# EAGLE design kitco5 (EAGLE 6.1)
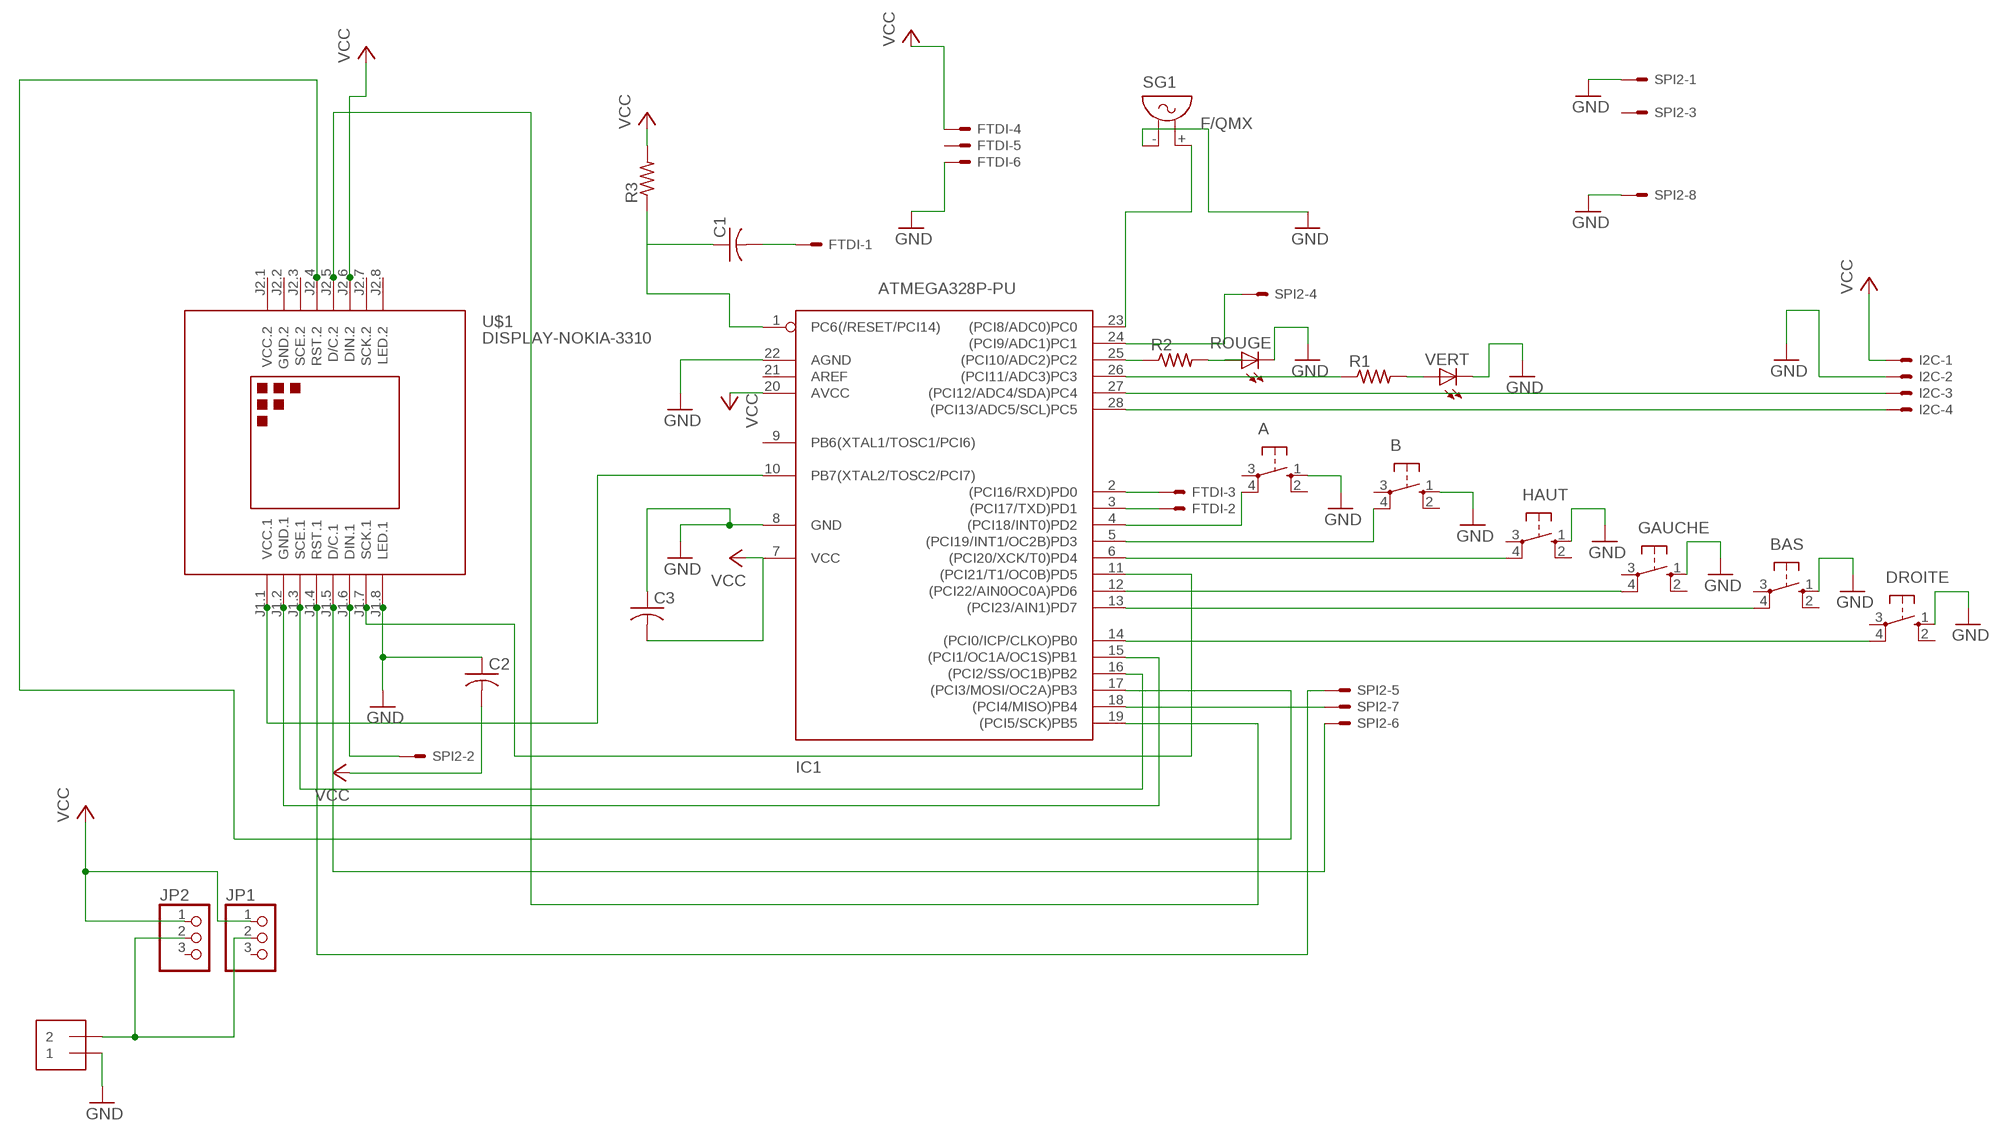
[diagram p0: schematic, sheet 1]

## Parts
A  10-XX  [B3F-10XX]
B  10-XX  [B3F-10XX]
BAS  10-XX  [B3F-10XX]
C1  C-US025-040X050  [C025-040X050]
C2  C-US025-040X050  [C025-040X050]
C3  C-US025-040X050  [C025-040X050]
DROITE  10-XX  [B3F-10XX]
FTDI  22-23-2061  [22-23-2061]
GAUCHE  10-XX  [B3F-10XX]
HAUT  10-XX  [B3F-10XX]
I2C  22-23-2041  [22-23-2041]
IC1  ATMEGA328P-PU  ATMEGA168V-10P  [DIL28-3]
J1  1X2-3.5MM  [1X2-3.5MM]
JP1  PINHD-1X3  [1X03]
JP2  PINHD-1X3  [1X03]
R1  R-US_0207/10  [0207/10]
R2  R-US_0207/10  [0207/10]
R3  R-US_0207/10  [0207/10]
ROUGE  LED5MM  [LED5MM]
SG1  F/QMX  [F/QMX]
SPI2  22-23-2081  [22-23-2081]
U$1  DISPLAY-NOKIA-3310  [DISPLAY-NOKIA-3310]
VERT  LED5MM  [LED5MM]

## Nets
GND: A.1(S) B.1(S) BAS.1(S) C2.1 C3.1 DROITE.1(S) FTDI.6 GAUCHE.1(S) HAUT.1(S) I2C.2 IC1.8(GND) IC1.22(AGND) J1.1 ROUGE.K(C) SG1.- SPI2.1 SPI2.8 U$1.J1.8(LED.1) VERT.K(C)
N$1: A.4(P1) IC1.4((PCI18/INT0)PD2)
N$2: B.4(P1) IC1.5((PCI19/INT1/OC2B)PD3)
N$3: IC1.11((PCI21/T1/OC0B)PD5) U$1.J1.7(SCK.1)
N$4: GAUCHE.4(P1) IC1.12((PCI22/AIN0OC0A)PD6)
N$5: BAS.4(P1) IC1.13((PCI23/AIN1)PD7)
N$6: DROITE.4(P1) IC1.14((PCI0/ICP/CLKO)PB0)
N$7: I2C.3 IC1.27((PCI12/ADC4/SDA)PC4)
N$8: I2C.4 IC1.28((PCI13/ADC5/SCL)PC5)
N$9: J1.2 JP1.2 JP2.2
N$10: HAUT.4(P1) IC1.6((PCI20/XCK/T0)PD4)
N$11: FTDI.2 IC1.3((PCI17/TXD)PD1)
N$12: IC1.26((PCI11/ADC3)PC3) R1.1
N$13: R1.2 VERT.A
N$14: IC1.25((PCI10/ADC2)PC2) R2.1
N$15: R2.2 ROUGE.A
N$16: IC1.24((PCI9/ADC1)PC1) SPI2.4
N$17: IC1.17((PCI3/MOSI/OC2A)PB3) U$1.J2.4(RST.2)
N$18: IC1.19((PCI5/SCK)PB5) U$1.J2.5(D/C.2)
N$19: IC1.15((PCI1/OC1A/OC1S)PB1) U$1.J1.2(GND.1)
N$20: IC1.16((PCI2/SS/OC1B)PB2) U$1.J1.3(SCE.1)
N$21: FTDI.3 IC1.2((PCI16/RXD)PD0)
N$22: IC1.18((PCI4/MISO)PB4) SPI2.7
N$23: IC1.23((PCI8/ADC0)PC0) SG1.+
N$24: SPI2.5 U$1.J1.4(RST.1)
N$25: C1.2 FTDI.1
N$26: SPI2.6 U$1.J1.5(D/C.1)
N$27: SPI2.2 U$1.J1.6(DIN.1)
N$29: C1.1 IC1.1(PC6(/RESET/PCI14)) R3.1
N$30: IC1.10(PB7(XTAL2/TOSC2/PCI7)) U$1.J1.1(VCC.1)
VCC: C2.2 C3.2 FTDI.4 I2C.1 IC1.7(VCC) IC1.20(AVCC) JP1.1 JP2.1 R3.2 U$1.J2.6(DIN.2)
Unconnected: A.2(S1) A.3(P) B.2(S1) B.3(P) BAS.2(S1) BAS.3(P) DROITE.2(S1) DROITE.3(P) FTDI.5 GAUCHE.2(S1) GAUCHE.3(P) HAUT.2(S1) HAUT.3(P) IC1.9(PB6(XTAL1/TOSC1/PCI6)) IC1.21(AREF) JP1.3 JP2.3 SPI2.3 U$1.J2.3(SCE.2) U$1.J2.7(SCK.2) U$1.J2.8(LED.2)

## Power pins joined to a net without a drawn wire
GND.2: U$1.J2.2(GND.2)
VCC.2: U$1.J2.1(VCC.2)

## Library data of the parts
A B BAS DROITE GAUCHE HAUT = switch-omron:10-XX: OMRON SWITCH; MPN: B3F-1000; OC_FARNELL: 176432; OC_NEWARK: 36M3542
C1-C3 = adafruit:C-US: CAPACITOR, American symbol
FTDI = con-molex:22-23-2061: .100" (2.54mm) Center Header - 6 Pin; MF: MOLEX; MPN: 22-23-2061; OC_FARNELL: 1462922; OC_NEWARK: 27C1933
I2C = con-molex:22-23-2041: .100" (2.54mm) Center Header - 4 Pin; MF: MOLEX; MPN: 22-23-2041; OC_FARNELL: 1462920; OC_NEWARK: 38C0355
IC1 = adafruit:ATMEGA168*P: MICROCONTROLLER 16 kBytes FLASH 1 kBytes SRAM 512 Bytes EEPROM USART 8-channel 10 bit ADC
J1 = adafruit:1X2: 3.5mm Terminal block http://www.ladyada.net/library/pcb/eaglelibrary.html
JP1 JP2 = adafruit:PINHD-1X3: PIN HEADER
R1-R3 = adafruit:R-US_: RESISTOR, American symbol
ROUGE VERT = adafruit:LED: LED OSRAM: - CHIPLED LG R971, LG N971, LY N971, LG Q971, LY Q971, LO R971, LY R971 LH N974, LH R974 LS Q976, LO Q976, LY Q976 LO Q996 - Hyper CHIPLED LW Q18S LB Q993, LB Q99A, LB R99A - SideLED LS A670, LO A670, LY A670, LG A670, LP A670 LB A673, LV A673, LT A673, LW A673 LH A674 LY A675 LS A676, LA A676, LO A676, LY A676, LW A676 LS A679, LY A679, LG A679 - Hyper Micro SIDELED® LS Y876, LA Y876, LO Y876, LY Y876 LT Y87S - SmartLED LW L88C, LW L88S LB L89C, LB L89S, LG L890 LS L89K, LO L89K, LY L89K LS L896, LA L896, LO L896, LY L896 - TOPLED LS T670, LO T670, LY T670, LG T670, LP T670 LSG T670, LSP T670, LSY T670, LOP T670, LYG T670 LG T671, LOG T671, LSG T671 LB T673, LV T673, LT T673, LW T673 LH T674 LS T676, LA T676, LO T676, LY T676, LB T676, LH T676, LSB T676, LW T676 LB T67C, LV T67C, LT T67C, LS T67K, LO T67K, LY T67K, LW E67C LS E67B, LA E67B, LO E67B, LY E67B, LB E67C, LV E67C, LT E67C LW T67C LS T679, LY T679, LG T679 LS T770, LO T770, LY T770, LG T770, LP T770 LB T773, LV T773, LT T773, LW T773 LH T774 LS E675, LA E675, LY E675, LS T675 LS T776, LA T776, LO T776, LY T776, LB T776 LHGB T686 LT T68C, LB T68C - Hyper Mini TOPLED® LB M676 - Mini TOPLED Santana® LG M470 LS M47K, LO M47K, LY M47K Source: http://www.osram.convergy.de/
SG1 = buzzer:F/QMX: BUZZER Source: Buerklin; OC_FARNELL: unknown; OC_NEWARK: unknown
SPI2 = con-molex:22-23-2081: .100" (2.54mm) Center Header - 8 Pin; MF: MOLEX; MPN: 22-23-2081; OC_FARNELL: 1756826; OC_NEWARK: 01C7592
U$1 = diy-modules:DISPLAY-NOKIA-3310: 84x48 Dot Matrix LCD Module based on Nokia 3310 display

## Board
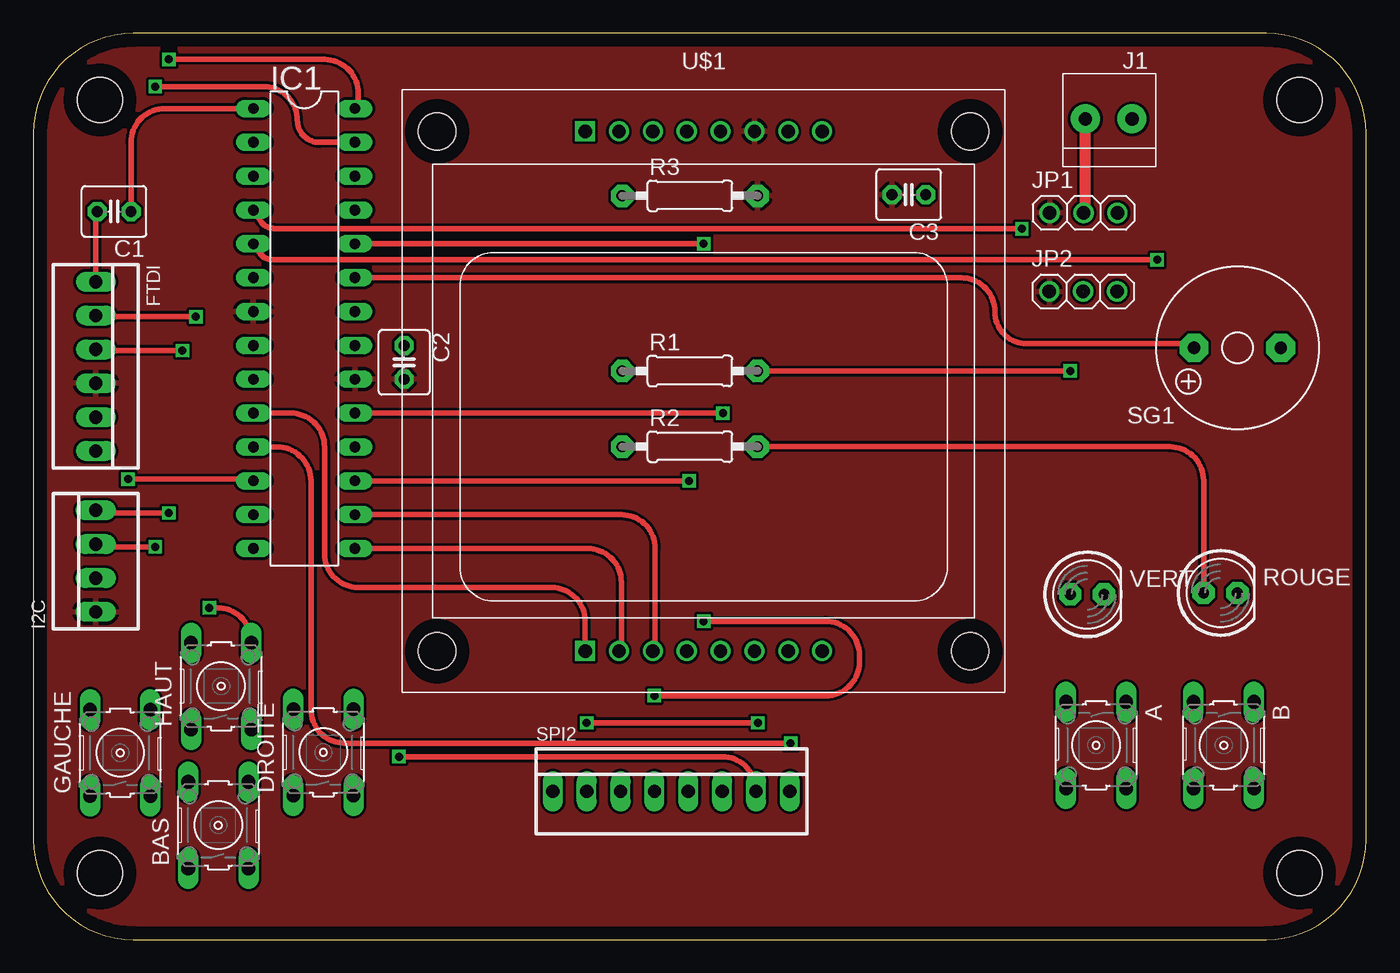
[diagram p1: board, top side]
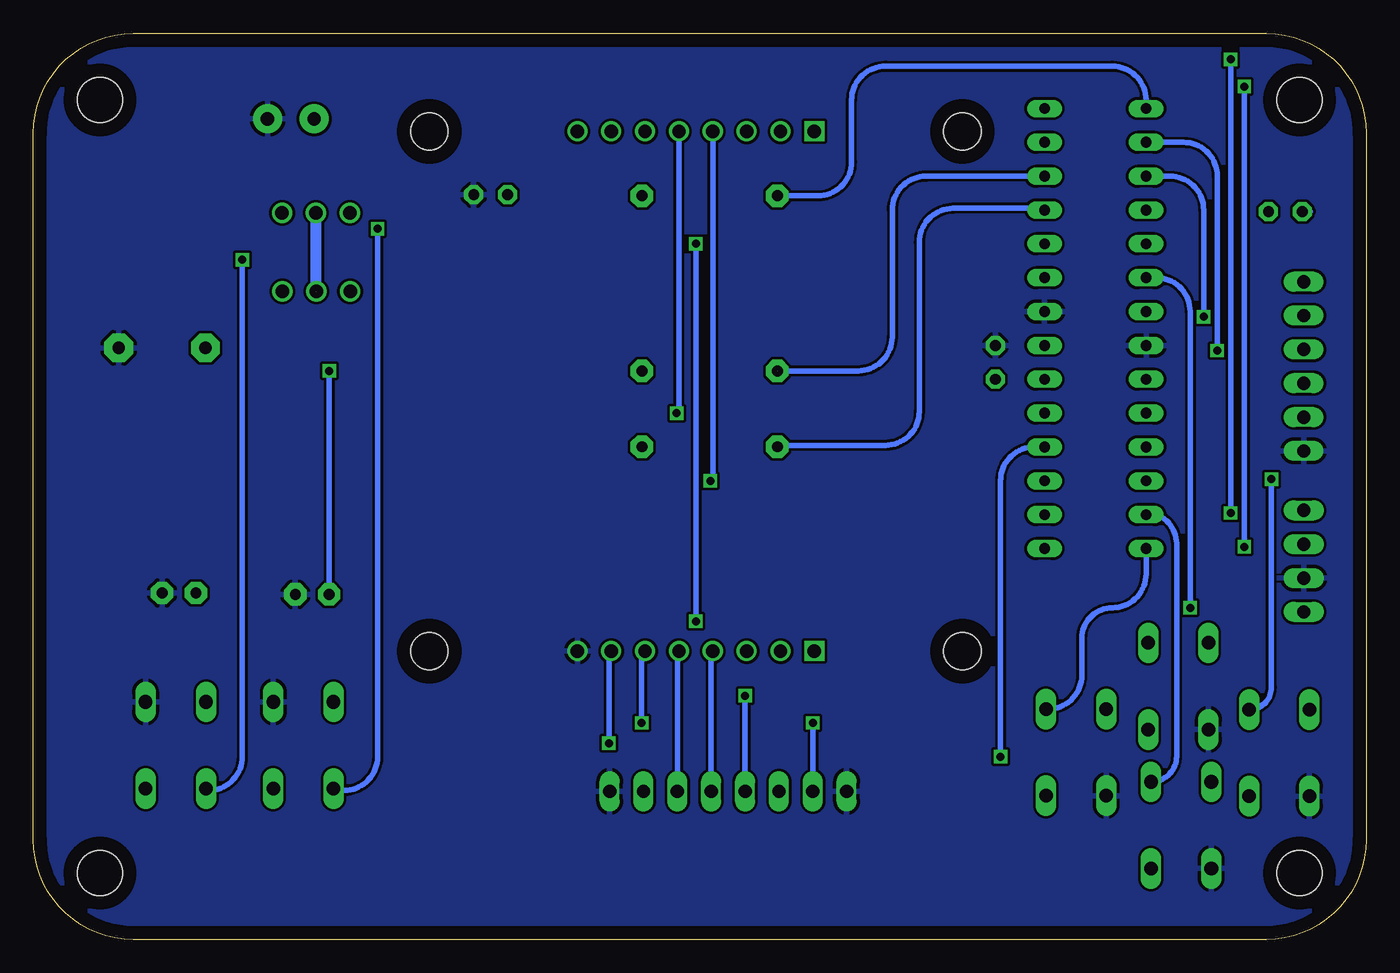
[diagram p2: board, bottom side, seen from below]

Size 100 x 68 mm. Coordinates in mm from the lower left corner, seen from the top.
Outline: 0,60.5 0,7.5 arc90 7.5,0 92.5,0 arc90 100,7.5 100,60.5 arc90 92.5,68 7.5,68 arc90 0,60.5
Copper layers (1*16): Top 0.035mm / dielectric 1.5mm / Bottom 0.035mm
Design rules: minimum track width 10mil, minimum drill 24mil, track to track 8mil, track to pad 8mil, pad to pad 8mil, via to via 8mil, smd to smd 8mil, copper to edge 40mil, drill to drill 8mil, minimum pad ring 10mil, minimum via ring 8mil, stop-mask expansion 4mil, vias tented up to drill 0mil, thermal gap 10mil
Holes 3.4 mm at 95,63 95,5 5,5 5,63

### Footprints (pad centres in the part's own frame; a part is rotated, then mirrored left to right if it is on the bottom)
B3F-10XX = drill 1.016 long: 1 -3.251,2.261; 2 3.251,2.261; 3 -3.251,-2.261; 4 3.251,-2.261
C025-040X050 = drill 0.813 pad 1.422 octagon: 1 -1.27,0; 2 1.27,0
22-23-2061 = drill 1 long: 1 -6.35,0; 2 -3.81,0; 3 -1.27,0; 4 1.27,0; 5 3.81,0; 6 6.35,0
22-23-2041 = drill 1 long: 1 -3.81,0; 2 -1.27,0; 3 1.27,0; 4 3.81,0
DIL28-3 = drill 0.813 long: 1 -16.51,-3.81; 2 -13.97,-3.81; 3 -11.43,-3.81; 4 -8.89,-3.81; 5 -6.35,-3.81; 6 -3.81,-3.81; 7 -1.27,-3.81; 8 1.27,-3.81; 9 3.81,-3.81; 10 6.35,-3.81; 11 8.89,-3.81; 12 11.43,-3.81; 13 13.97,-3.81; 14 16.51,-3.81; 15 16.51,3.81; 16 13.97,3.81; 17 11.43,3.81; 18 8.89,3.81; 19 6.35,3.81; 20 3.81,3.81; 21 1.27,3.81; 22 -1.27,3.81; 23 -3.81,3.81; 24 -6.35,3.81; 25 -8.89,3.81; 26 -11.43,3.81; 27 -13.97,3.81; 28 -16.51,3.81
1X2-3.5MM = drill 1 pad 2.184: 1 1.8,0; 2 -1.7,0
1X03 = drill 1.016: 1 -2.54,0; 2 0,0; 3 2.54,0
0207/10 = drill 0.813 pad 1.676 octagon: 1 -5.08,0; 2 5.08,0
LED5MM = drill 0.813 pad 1.676 octagon: A -1.27,0; K 1.27,0
F/QMX = drill 0.914 pad 2.159 octagon: + 3.251,0; - -3.251,0
22-23-2081 = drill 1 long: 1 -8.89,0; 2 -6.35,0; 3 -3.81,0; 4 -1.27,0; 5 1.27,0; 6 3.81,0; 7 6.35,0; 8 8.89,0
DISPLAY-NOKIA-3310 = drill 1 square: J1.1 -8.89,-19.5; J2.1 -8.89,19.5 | drill 1: J1.2 -6.35,-19.5; J1.3 -3.81,-19.5; J1.4 -1.27,-19.5; J1.5 1.27,-19.5; J1.6 3.81,-19.5; J1.7 6.35,-19.5; J1.8 8.89,-19.5; J2.2 -6.35,19.5; J2.3 -3.81,19.5; J2.4 -1.27,19.5; J2.5 1.27,19.5; J2.6 3.81,19.5; J2.7 6.35,19.5; J2.8 8.89,19.5 | hole 2.8: -20,-19.5; 20,-19.5; 20,19.5; -20,19.5

### Placement (x,y rotation side)
A  79.74,14.58 270 top
B  89.31,14.58 270 top
BAS  13.88,8.58 90 top
C1  6.06,54.63 180 top
C2  27.82,43.31 270 top
C3  65.68,55.89 180 top
DROITE  21.76,14.05 90 top
FTDI  4.69,43.01 270 top
GAUCHE  6.52,14.01 90 top
HAUT  14.09,19.01 90 top
I2C  4.69,28.39 90 top
IC1  20.32,45.85 270 top
J1  80.63,61.58 0 top
JP1  78.8,54.53 0 top
JP2  78.77,48.63 0 top
R1  49.26,42.66 0 top
R2  49.26,36.98 0 top
R3  49.26,55.81 0 top
ROUGE  89.07,26.01 0 top
SG1  90.34,44.4 180 top
SPI2  47.87,11.12 0 top
U$1  50.29,41.15 0 top
VERT  79.07,25.9 0 top

### Tracks (layer width: path | path; a pad name or v marks a point on that pad's centre or on a via)
GND
  pour Bottom: -2,-2 -2,69 101,69 101,-2
N$1  (via drill 0.6)
  Top 0.406: IC1.4 16.76,54.74 arc90 18.16,53.34 v74.17,53.34
  Bottom 0.254: 74.12,13.77 arc-90 74.17,13.72
  Bottom 0.406: v74.17,53.34 74.17,13.72 arc90 76.71,11.18 77.48,11.18 A.4
N$2  (via drill 0.6)
  Top 0.406: IC1.5 16.76,52.2 arc90 17.96,51 v84.33,51
  Bottom 0.406: v84.33,51 84.33,13.72 arc90 86.87,11.18 87.05,11.18 B.4
N$3  (via drill 0.6)
  Top 0.406: IC1.11 18.29,36.96 arc-90 20.83,34.42 20.83,17.27 arc90 23.37,14.73 v56.82,14.73
  Bottom 0.406: U$1.J1.7 56.82,21.65 v56.82,14.73
N$4  (via drill 0.6)
  Top 0.406: v7.11,34.54 16.51,34.54
  Top 0.813: 16.51,34.54 IC1.12
  Bottom 0.406: GAUCHE.4 arc-90 7.11,18.93 v7.11,34.54
N$5
  Bottom 0.406: BAS.4 arc-90 14.22,13.75 14.22,29.72 arc-90 16.51,32
  Bottom 0.813: 16.51,32 IC1.13
N$6
  Bottom 0.406: DROITE.4 23.88,17.3 arc-90 21.34,19.84 21.34,22.61 arc90 19.05,24.89 arc-90 16.51,27.43 IC1.14
N$7  (via drill 0.6)
  Top 0.406: IC1.27 21.46,59.82 arc-90 19.81,61.47 arc90 17.27,64.01 v9.14,64.01 | v9.14,29.46 4.68,29.46
  Top 0.813: 4.68,29.46 I2C.3
  Bottom 0.406: v9.14,64.01 v9.14,29.46
N$8  (via drill 0.6)
  Top 0.406: 24.38,62.36 24.38,63.5 arc90 21.84,66.04 v10.16,66.04 | v10.16,32 4.68,32
  Top 0.813: IC1.28 24.38,62.36 | 4.68,32 I2C.4
  Bottom 0.406: v10.16,66.04 v10.16,32
N$9  (1 unrouted)
  Top 0.813: JP1.2 78.93,54.53 J1.2
  Bottom 0.813: 78.8,48.63 JP1.2
N$10  (via drill 0.6)
  Top 0.406: v13.21,24.89 13.81,24.89 arc-90 16.35,22.35 HAUT.4
  Bottom 0.406: IC1.6 15.75,49.66 arc90 13.21,47.12 v13.21,24.89
N$11  (via drill 0.6)
  Top 0.406: v12.19,46.74 4.69,46.74
  Top 0.813: 4.69,46.74 FTDI.2
  Bottom 0.406: IC1.3 14.73,57.28 arc90 12.19,54.74 v12.19,46.74
N$12  (1 unrouted)
  Bottom 0.406: IC1.26 33.02,57.28 arc-90 35.56,54.74 35.56,45.21 arc90 38.1,42.67 44.18,42.67
N$13  (via drill 0.6)
  Top 0.406: R1.2 v77.8,42.66
  Bottom 0.406: v77.8,42.66 VERT.A
N$14
  Bottom 0.406: 24.13,54.86 30.99,54.86 arc-90 33.53,52.32 33.53,39.62 arc90 36.07,37.08 44.18,37.08 R2.1
  Bottom 0.813: 24.13,54.86 IC1.25
N$15
  Top 0.406: ROUGE.A 87.8,34.44 arc90 85.26,36.98 R2.2
N$16  (via drill 0.6)
  Top 0.406: IC1.24 v50.29,52.2 | v50.29,23.88 59.44,23.88 arc-90 61.98,21.34 61.98,20.83 arc-90 59.44,18.29 v46.6,18.29
  Bottom 0.406: v50.29,52.2 v50.29,23.88 | v46.6,18.29 SPI2.4
N$17  (via drill 0.6)
  Top 0.406: IC1.17 v49.2,34.42
  Bottom 0.406: v49.2,34.42 49.02,34.42 U$1.J2.4
N$18  (via drill 0.6)
  Top 0.406: IC1.19 v51.74,39.5
  Bottom 0.406: v51.74,39.5 51.56,39.5 U$1.J2.5
N$19
  Top 0.406: IC1.15 41.58,29.34 arc-90 44.12,26.8 44.12,21.65 U$1.J1.2
N$20
  Top 0.406: IC1.16 44.12,31.88 arc-90 46.66,29.34 46.66,21.65 U$1.J1.3
N$21  (via drill 0.6)
  Top 0.406: v11.18,44.2 4.69,44.2
  Top 0.813: 4.69,44.2 FTDI.3
  Bottom 0.406: IC1.2 13.72,59.82 arc90 11.18,57.28 v11.18,44.2
N$22  (via drill 0.6)
  Top 0.406: v27.43,13.72 51.68,13.72 arc-90 54.22,11.18 SPI2.7
  Bottom 0.406: IC1.18 24.89,36.96 arc-90 27.43,34.42 v27.43,13.72
N$23
  Top 0.406: IC1.23 69.6,49.66 arc-90 72.14,47.12 arc90 74.55,44.7 87.09,44.7 SG1.+
N$24
  Bottom 0.406: SPI2.5 49.14,20.32 49.14,20.99 49.14,21.65 U$1.J1.4
N$25
  Top 0.406: 4.69,54.63 FTDI.1
  Top 0.813: C1.2 4.69,54.63
  Bottom 0.406: C1.2 4.19,54.63
N$26
  Bottom 0.406: SPI2.6 51.68,21.65 U$1.J1.5
N$27  (via drill 0.6)
  Top 0.406: v54.36,16.26 v41.52,16.26
  Bottom 0.406: v54.36,16.26 54.36,21.65 U$1.J1.6 | v41.52,16.26 SPI2.2
N$29
  Top 0.406: IC1.1 9.87,62.36 arc90 7.33,59.82 C1.1
  Bottom 0.406: R3.1 41.15,55.81 arc-90 38.61,58.35 38.61,62.99 arc90 36.07,65.53 19.05,65.53 arc90 16.51,62.99 IC1.1
N$30
  Top 0.406: IC1.10 19.3,39.5 arc-90 21.84,36.96 21.84,28.96 arc90 24.38,26.42 38.86,26.42 arc-90 41.4,23.88 U$1.J1.1
VCC
  Bottom 0.406: 28.08,41.78 arc-90 C2.2 | C3.2 arc90 64.13,55.61
  pour Top: -5.05,-3.52 -4.93,63.57 arc-90 3.05,71.52 102.65,71.29 102.52,-3.78

### Text on the board
tTestmark: + | - | C1 | C3 | R3 | Inter. | Microcontroleur | C2 | Buzzer | R1 | FTDI | R2 | Vert | Rouge | I2C | A | B | H | G | D | SPI | KitCo.fr | KitCo v1.1 | B
bTestmark: + Rouge | Noir - | RST | tx (D1) | rx (D0) | Vcc | Gnd | SCL (A5) | SDA (A4) | Gnd | Vcc | Gnd | Vcc | (A1) | MOSI | SCK | MISO | Gnd
200bmp: /Users/alex/Desktop/Logo2.bmp